# Altium project IOT.PrjPCB
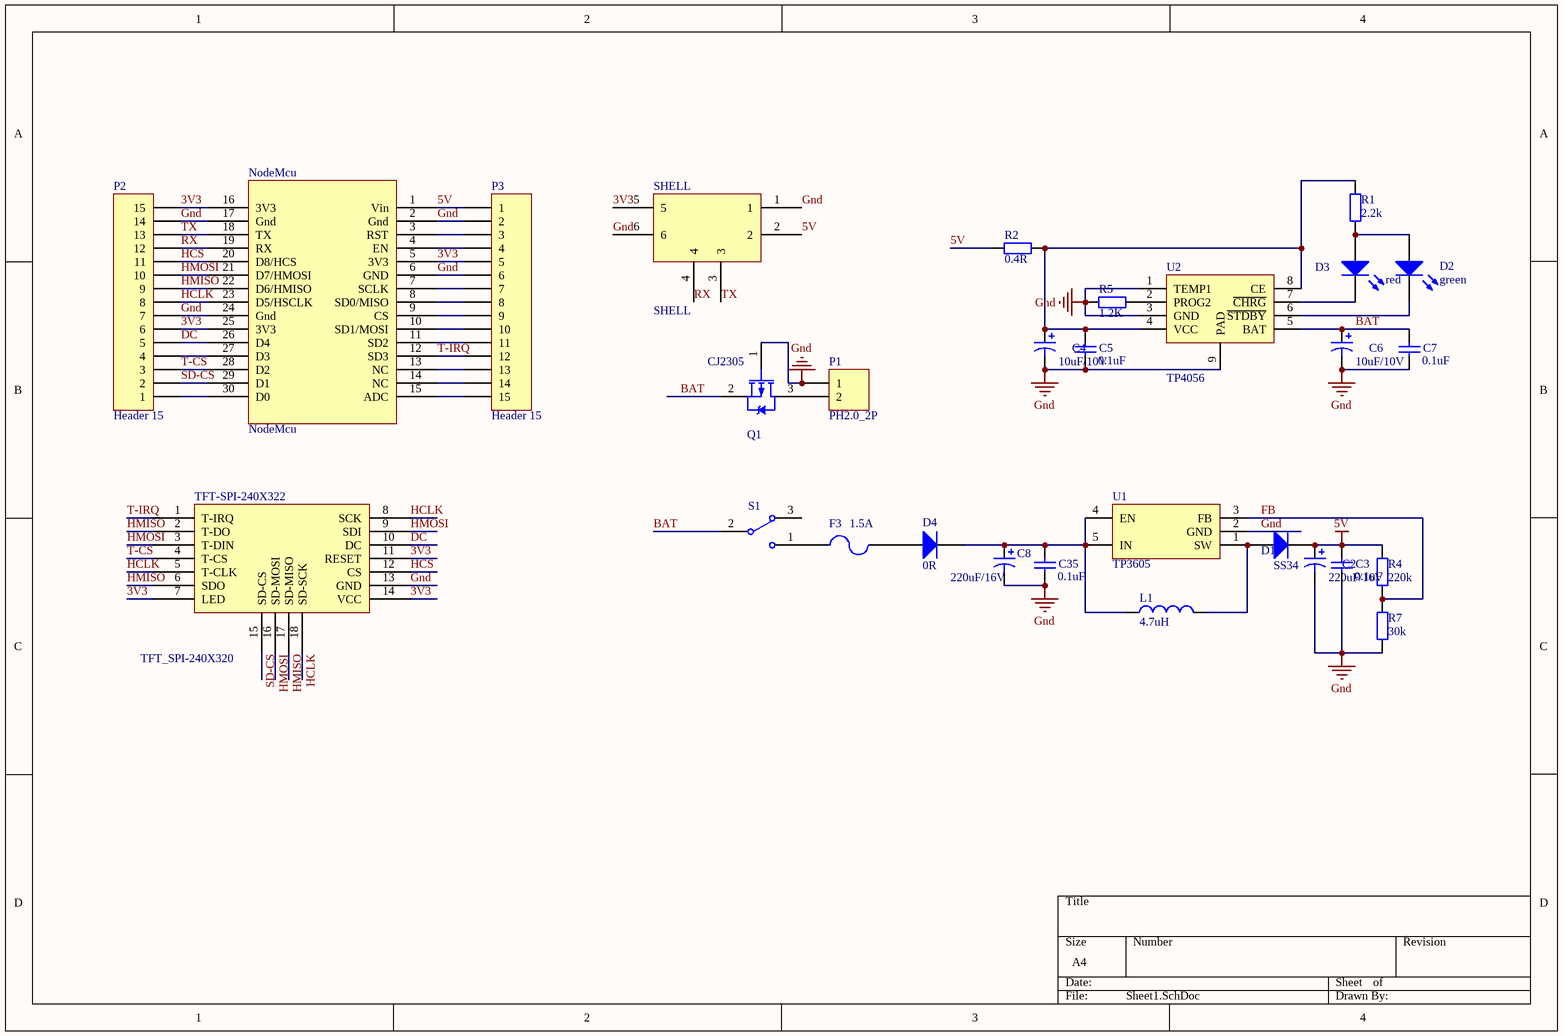
[diagram p0: Sheet1.SchDoc]
1 sheet, 29 parts. Net scope: global (net labels, ports and power ports of the same name join across sheets).
Board file: IOT.PcbDoc

## Sheet Sheet1.SchDoc
size A4

### Parts
C2  220uF/16V  [SMT-EC-D6.3]
C3  0.1uF  [C0603]
C4  10uF/10V  [C0805]
C5  0.1uF  [C0603]
C6  10uF/10V  [C0805]
C7  0.1uF  [C0603]
C8  220uF/16V  [SMT-EC-D6.3]
C35  0.1uF  [C0603]
D1  SS34  [DO-214]
D2  green  [D0603]
D3  red  [D0603]
D4  0R  [DO-214]
F3  1.5A  [RESC4532AN]
L1  4.7uH  [L4532]
NodeMcu  NodeMcu  [NodeMcu]
P1  PH2.0_2P  [CON_PH2.0_2P]
P2  Header 15  [HDR1X15]
P3  Header 15  [HDR1X15]
Q1  CJ2305  [SOT-23-3]
R1  2.2k  [R0603]
R2  0.4R  [R0805]
R4  220k  [R0603]
R5  1.2K  [R0603]
R7  30k  [R0603]
S1  SS-12D06  [SW-SS-12D06]  (value not drawn)
SHELL  SHELL  [SHELL]
TFT-SPI-240X322  TFT_SPI-240X320  [TFT-SPI-240X320]
U1  TP3605  [SOT-23-6]
U2  TP4056  [SOIC127P600-8DN]

### Nets
5V: C2.1 C3.1 D1.2(K) NodeMcu.1(Vin) P3.1 R2.2 R4.2 SHELL.2
Gnd: C2.2 C3.2 C4.2 C5.2 C6.2 C7.2 C8.2 C35.2 NodeMcu.2(Gnd) NodeMcu.6(GND) NodeMcu.17(Gnd) NodeMcu.24(Gnd) P1.1 P2.7 P2.14 P3.2 P3.6 Q1.1(G) R5.1 R7.1 SHELL.1 SHELL.6 TFT-SPI-240X322.13(GND) U1.2(GND) U2.1(TEMP1) U2.3(GND) U2.9(PAD)
3V3: NodeMcu.5(3V3) NodeMcu.16(3V3) NodeMcu.25(3V3) P2.6 P2.15 P3.5 SHELL.5 TFT-SPI-240X322.7(LED) TFT-SPI-240X322.11(RESET) TFT-SPI-240X322.14(VCC)
BAT: C6.1 C7.1 Q1.2(S) S1.2 U2.5(BAT)
DC: NodeMcu.26(D4) P2.5 TFT-SPI-240X322.10(DC)
FB: R4.1 R7.2 U1.3(FB)
HCLK: NodeMcu.23(D5/HSCLK) P2.8 TFT-SPI-240X322.5(T-CLK) TFT-SPI-240X322.8(SCK) TFT-SPI-240X322.18(SD-SCK)
HCS: NodeMcu.20(D8/HCS) P2.11 TFT-SPI-240X322.12(CS)
HMISO: NodeMcu.22(D6/HMISO) P2.9 TFT-SPI-240X322.2(T-DO) TFT-SPI-240X322.6(SDO) TFT-SPI-240X322.17(SD-MISO)
HMOSI: NodeMcu.21(D7/HMOSI) P2.10 TFT-SPI-240X322.3(T-DIN) TFT-SPI-240X322.9(SDI) TFT-SPI-240X322.16(SD-MOSI)
RX: NodeMcu.19(RX) P2.12 SHELL.4
SD-CS: NodeMcu.29(D1) P2.2 TFT-SPI-240X322.15(SD-CS)
T-CS: NodeMcu.28(D2) P2.3 TFT-SPI-240X322.4(T-CS)
T-IRQ: NodeMcu.12(SD3) P3.12 TFT-SPI-240X322.1(T-IRQ)
TX: NodeMcu.18(TX) P2.13 SHELL.3
NetC4_1: C4.1 C5.1 R1.2 R2.1 U2.4(VCC) U2.8(CE)
NetC8_1: C8.1 C35.1 D4.2(K) L1.1 U1.4(EN) U1.5(IN)
NetD1_1: D1.1(A) L1.2 U1.1(SW)
NetD2_1: D2.1(A) D3.1(A) R1.1
NetD2_2: D2.2(K) U2.6(~{STDBY})
NetD3_2: D3.2(K) U2.7(~{CHRG})
NetD4_1: D4.1(A) F3.2
NetF3_1: F3.1 S1.1
NetNodeMcu_3: NodeMcu.3(RST) P3.3
NetNodeMcu_4: NodeMcu.4(EN) P3.4
NetNodeMcu_7: NodeMcu.7(SCLK) P3.7
NetNodeMcu_8: NodeMcu.8(SD0/MISO) P3.8
NetNodeMcu_9: NodeMcu.9(CS) P3.9
NetNodeMcu_10: NodeMcu.10(SD1/MOSI) P3.10
NetNodeMcu_11: NodeMcu.11(SD2) P3.11
NetNodeMcu_13: NodeMcu.13(NC) P3.13
NetNodeMcu_14: NodeMcu.14(NC) P3.14
NetNodeMcu_15: NodeMcu.15(ADC) P3.15
NetNodeMcu_27: NodeMcu.27(D3) P2.4
NetNodeMcu_30: NodeMcu.30(D0) P2.1
NetP1_2: P1.2 Q1.3(D)
NetR5_2: R5.2 U2.2(PROG2)

Not connected (* = marked no-connect by the designer): S1 3

### Library data of the parts
C2 = Cap Pol1: 贴片电解电容 6.3X7.7; Published: 8-Jun-2000; LatestRevisionDate: 17-Jul-2002; LatestRevisionNote: Re-released for DXP Platform.; PackageReference: RB7.6-15; Publisher: Altium Limited
C3 C5 C7 C35 = Cap: Capacitor 0603 10% 50V; Published: 8-Jun-2000; LatestRevisionDate: 17-Jul-2002; LatestRevisionNote: Re-released for DXP Platform.; PackageReference: RAD-0.3; Publisher: Altium Limited; Value: 0.1uF
C4 C6 = Cap Pol1: Capacitor 0805 10% 10V; Published: 8-Jun-2000; LatestRevisionDate: 17-Jul-2002; LatestRevisionNote: Re-released for DXP Platform.; PackageReference: RB7.6-15; Publisher: Altium Limited
C8 = Cap Pol1: 贴片电解电容 6.3X7.7; Value: 1000uF/16V; Published: 8-Jun-2000; LatestRevisionDate: 17-Jul-2002; LatestRevisionNote: Re-released for DXP Platform.; PackageReference: RB7.6-15; Publisher: Altium Limited
D1 = Diode: Diode DO214-AC; Published: 8-Jun-2000; LatestRevisionDate: 17-Jul-2002; LatestRevisionNote: Re-released for DXP Platform.; PackageDocument: Sep-1996; PackageReference: SMC; Publisher: Altium Limited; Code_JEDEC: DO-214-AB; Value: SS34
D2 D3 = LED3: LED, Red 0603 (1608); value: led-red; Published: 8-Jun-2000; LatestRevisionDate: 17-Dec-2003; LatestRevisionNote: PCB Footprint replaced.; DatasheetVersion: 16-Apr-2002; PackageVersion: 16-Apr-2002; PackageReference: 3.5X2.8X1.9; Publisher: Altium Limited
D4 = Diode: 0R 1% 1206; Value: SS34; Published: 8-Jun-2000; LatestRevisionDate: 17-Jul-2002; LatestRevisionNote: Re-released for DXP Platform.; PackageDocument: Sep-1996; PackageReference: SMC; Publisher: Altium Limited; Code_JEDEC: DO-214-AB
F3 = Fuse 2: 自恢复保险丝 25V 1812; Published: 8-Jun-2000; LatestRevisionDate: 17-Jul-2002; LatestRevisionNote: Re-released for DXP Platform.; PackageReference: PIN-W2/E2.8; Publisher: Altium Limited
L1 = Inductor: GDCD4532-4R7MT; Code_IEC: 1005; Value: GDCD1054-6R8MT; Published: 8-Jun-2000; LatestRevisionDate: 17-Jul-2002; LatestRevisionNote: Re-released for DXP Platform.; PackageReference: 0402-A; Publisher: Altium Limited; Code_JEITA: 0402
P1 = Header 2: LatestRevisionDate: 17-Jul-2002; LatestRevisionNote: Re-released for DXP Platform.; Publisher: Altium Limited
P2 P3 = Header 15: Header, 15-Pin; LatestRevisionDate: 17-Jul-2002; LatestRevisionNote: Re-released for DXP Platform.; Publisher: Altium Limited
Q1 = PMOS: PMOS CJ2305 SOT-23; value: CJ3401
R1 R4 R5 R7 = Res2: Resistor,  1% 0603 (1608); Published: 8-Jun-2000; LatestRevisionDate: 17-Jul-2002; LatestRevisionNote: Re-released for DXP Platform.; PackageReference: AXIAL-0.4; Publisher: Altium Limited
R2 = Res2: Resistor,  1% 0805; Published: 8-Jun-2000; LatestRevisionDate: 17-Jul-2002; LatestRevisionNote: Re-released for DXP Platform.; PackageReference: AXIAL-0.4; Publisher: Altium Limited
S1 = SW-SPDT: 二档大拨动开关弯角拨动开关SS-12D06; value: 卧式拨动开关; Published: 24-Mar-1999; LatestRevisionDate: 17-Dec-2003; LatestRevisionNote: Schematic revised, PCB Footprint replaced.; DatasheetDocument: 05-Dec-2000; PackageReference: TL36WW15050; Publisher: Altium Limited; ComponentLink1Description: Manufacturer Link; ComponentLink1URL: http://www.apem.com
U1 = MP1540DJ: 电源 升压 IC
U2 = TP4056: 锂电池充电IC